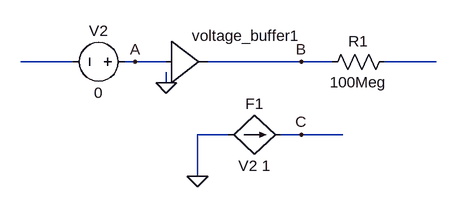
[diagram p0: schematic Draft2.asc]
Draft2.asc, the LTspice schematic file:
Version 4
SHEET 1 880 680
WIRE -64 112 -144 112
WIRE 32 112 16 112
WIRE 80 112 32 112
WIRE 288 112 144 112
WIRE 336 112 288 112
WIRE 496 112 416 112
WIRE 80 144 80 128
WIRE 176 224 128 224
WIRE 288 224 256 224
WIRE 352 224 288 224
WIRE 128 288 128 224
FLAG 288 112 B
FLAG 288 224 C
FLAG 32 112 A
FLAG 80 144 0
FLAG 128 288 0
SYMBOL Digital\\buf1 80 48 R0
SYMATTR InstName voltage_buffer1
SYMBOL res 320 128 R270
WINDOW 0 32 56 VTop 2
WINDOW 3 0 56 VBottom 2
SYMATTR InstName R1
SYMATTR Value 100Meg
SYMBOL voltage 32 112 R90
WINDOW 0 -32 56 VBottom 2
WINDOW 3 32 56 VTop 2
SYMATTR InstName V2
SYMATTR Value 0
SYMBOL f 176 224 R270
WINDOW 0 32 40 VTop 2
WINDOW 3 -32 40 VBottom 2
SYMATTR InstName F1
SYMATTR Value V2 1

The netlist it stands for:
* Draft2.asc
A§voltage_buffer1 A 0 0 0 0 0 B 0 BUF
R1 B N002 100Meg
V2 A N001 0
F1 0 C V2 1
.backanno
.end